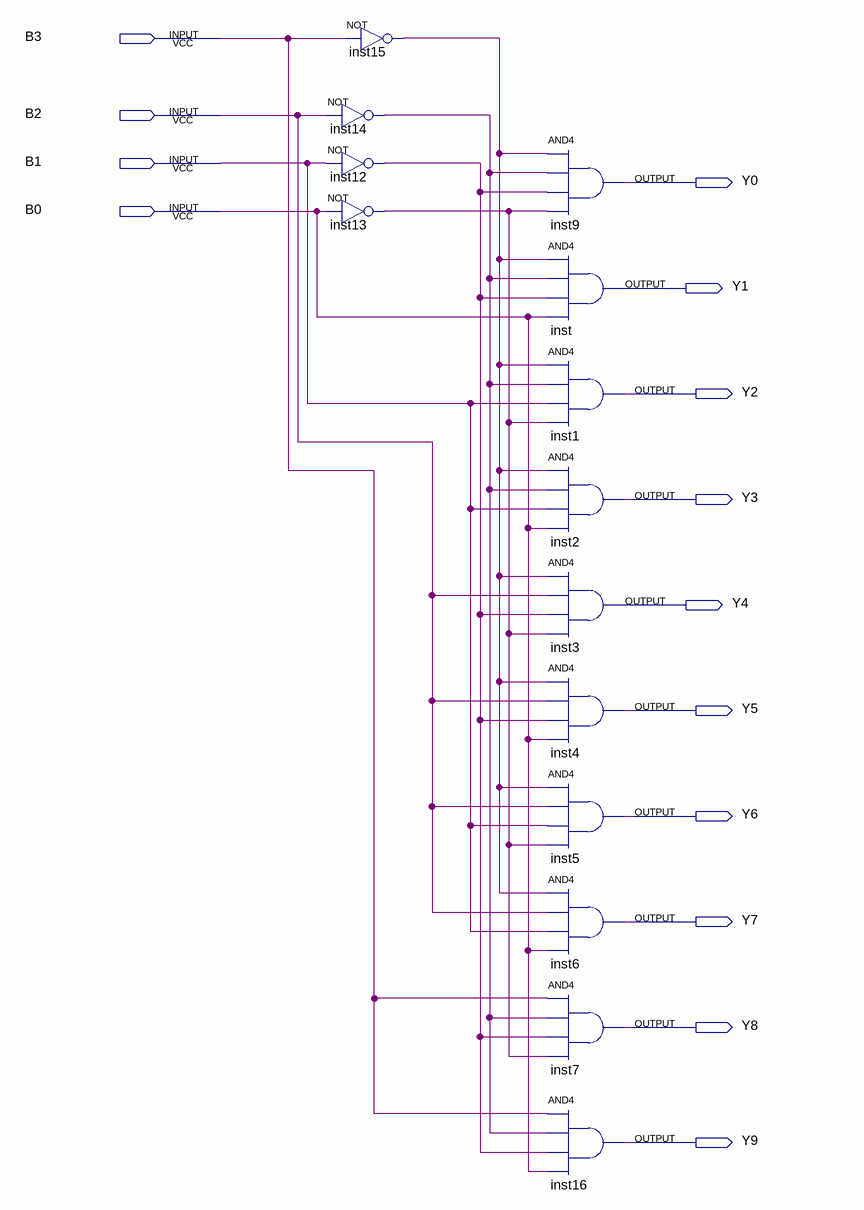
[diagram p0: schematic sheet]
// Quartus schematic BCD_7Seg.bdf as structural Verilog: 14 symbols, 14 pins
module BCD_7Seg (
  input  B3,
  input  B2,
  input  B1,
  input  B0,
  output Y0,
  output Y1,
  output Y2,
  output Y3,
  output Y4,
  output Y5,
  output Y6,
  output Y7,
  output Y8,
  output Y9
);

  wire inst12_out, inst13_out, inst14_out, inst15_out;

  not inst15 (inst15_out, B3);
  not inst14 (inst14_out, B2);
  not inst12 (inst12_out, B1);
  not inst13 (inst13_out, B0);
  and inst9 (Y0, inst15_out, inst14_out, inst12_out, inst13_out);
  and inst (Y1, inst15_out, inst14_out, inst12_out, B0);
  and inst1 (Y2, inst15_out, inst14_out, B1, inst13_out);
  and inst2 (Y3, inst15_out, inst14_out, B1, B0);
  and inst3 (Y4, inst15_out, B2, inst12_out, inst13_out);
  and inst4 (Y5, inst15_out, B2, inst12_out, B0);
  and inst5 (Y6, inst15_out, B2, B1, inst13_out);
  and inst6 (Y7, inst15_out, B2, B1, B0);
  and inst7 (Y8, B3, inst14_out, inst12_out, inst13_out);
  and inst16 (Y9, B3, inst14_out, inst12_out, B0);
endmodule
